# Altium project 6AxisEncoderFin.PrjPcb
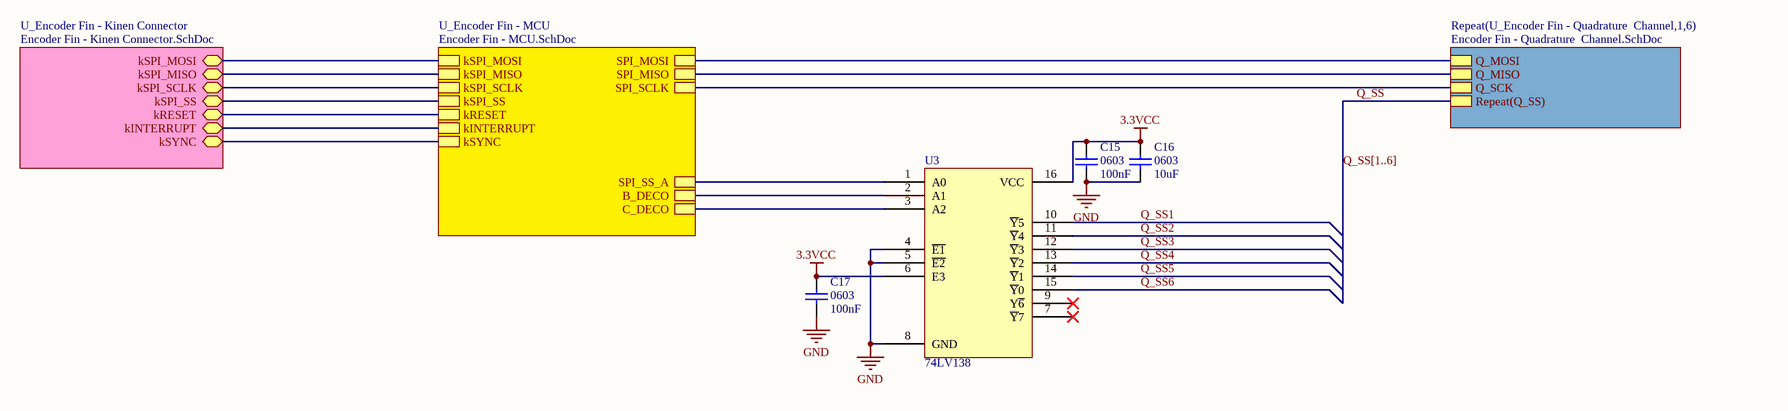
[diagram p0: Encoder Fin - System.SchDoc]
4 sheets, 79 parts. Net scope: hierarchical (ports join the sheet entries above them; power ports are global).
Board file: EncoderFin.PcbDoc
Sheets:
  Encoder Fin - System.SchDoc
    U_Encoder Fin - Quadrature  Channel1 = Encoder Fin - Quadrature  Channel.SchDoc
    U_Encoder Fin - Quadrature  Channel2 = Encoder Fin - Quadrature  Channel.SchDoc
    U_Encoder Fin - Quadrature  Channel3 = Encoder Fin - Quadrature  Channel.SchDoc
    U_Encoder Fin - Quadrature  Channel4 = Encoder Fin - Quadrature  Channel.SchDoc
    U_Encoder Fin - Quadrature  Channel5 = Encoder Fin - Quadrature  Channel.SchDoc
    U_Encoder Fin - Quadrature  Channel6 = Encoder Fin - Quadrature  Channel.SchDoc
    U_Encoder Fin - MCU = Encoder Fin - MCU.SchDoc
    U_Encoder Fin - Kinen Connector = Encoder Fin - Kinen Connector.SchDoc

## Sheet Encoder Fin - System.SchDoc
size B

### Parts
C15  0603  value 100nF  [1608[0603]]
C16  0603  value 10uF  [1608[0603]]
C17  0603  value 100nF  [1608[0603]]
U3  74LV138  [TSOP65P640X120-16N-74IC]

### Sub-sheets
Repeat(U_Encoder Fin - Quadrature  Channel,1,6) = Encoder Fin - Quadrature  Channel.SchDoc: Q_MOSI, Q_MISO, Q_SCK, Repeat(Q_SS)
U_Encoder Fin - Kinen Connector = Encoder Fin - Kinen Connector.SchDoc: kSPI_MOSI, kSPI_MISO, kSPI_SCLK, kSPI_SS, kRESET, kINTERRUPT, kSYNC
U_Encoder Fin - MCU = Encoder Fin - MCU.SchDoc: kSPI_MOSI, kSPI_MISO, kSPI_SCLK, kSPI_SS, kRESET, kINTERRUPT, kSYNC, SPI_SCLK, SPI_MISO, SPI_MOSI, B_DECO, C_DECO, SPI_SS_A

### Nets
3.3VCC: C15.2 C16.2 C17.2 U3.6(E3) U3.16(VCC)
GND: C15.1 C16.1 C17.1 U3.4(~{E1}) U3.5(~{E2}) U3.8(GND)
B_DECO: U3.2(A1) ; sheet U_Encoder Fin - MCU/B_DECO
C_DECO: U3.3(A2) ; sheet U_Encoder Fin - MCU/C_DECO
kSPI_MISO: sheet U_Encoder Fin - MCU/kSPI_MISO, sheet U_Encoder Fin - Kinen Connector/kSPI_MISO
kSPI_MOSI: sheet U_Encoder Fin - MCU/kSPI_MOSI, sheet U_Encoder Fin - Kinen Connector/kSPI_MOSI
kSPI_SCLK: sheet U_Encoder Fin - MCU/kSPI_SCLK, sheet U_Encoder Fin - Kinen Connector/kSPI_SCLK
kSPI_SS: sheet U_Encoder Fin - MCU/kSPI_SS, sheet U_Encoder Fin - Kinen Connector/kSPI_SS
Q_SS: sheet Repeat(U_Encoder Fin - Quadrature  Channel,1,6)/Repeat(Q_SS)
Q_SS1: U3.10(~{Y}5)
Q_SS2: U3.11(~{Y}4)
Q_SS3: U3.12(~{Y}3)
Q_SS4: U3.13(~{Y}2)
Q_SS5: U3.14(~{Y}1)
Q_SS6: U3.15(~{Y}0)
SPI_SS_A: U3.1(A0) ; sheet U_Encoder Fin - MCU/SPI_SS_A
NetP1_2: sheet U_Encoder Fin - MCU/kRESET, sheet U_Encoder Fin - Kinen Connector/kRESET
NetU1_33: sheet U_Encoder Fin - MCU/kSYNC, sheet U_Encoder Fin - Kinen Connector/kSYNC
NetU1_34: sheet U_Encoder Fin - MCU/kINTERRUPT, sheet U_Encoder Fin - Kinen Connector/kINTERRUPT
NetU1_42: sheet Repeat(U_Encoder Fin - Quadrature  Channel,1,6)/Q_MOSI, sheet U_Encoder Fin - MCU/SPI_MOSI
NetU1_43: sheet Repeat(U_Encoder Fin - Quadrature  Channel,1,6)/Q_MISO, sheet U_Encoder Fin - MCU/SPI_MISO
NetU1_44: sheet Repeat(U_Encoder Fin - Quadrature  Channel,1,6)/Q_SCK, sheet U_Encoder Fin - MCU/SPI_SCLK

Not connected (* = marked no-connect by the designer): U3 7(~{Y}7)* 9(Y~{6})*

### Buses and harness runs
bus Q_SS[1..6]

### Library data of the parts
C15-C17 = Cap Semi: Capacitor (Semiconductor SIM Model); Published: 8-Jun-2000; LatestRevisionDate: 29-May-2009; LatestRevisionNote: IPC-7351 Footprint Added.; PackageReference: C1206; Publisher: Altium Limited; PackageDescription: Chip Capacitor
U3 = 74LV138 - 3 to 8 Decoder NXP 3.3v/5v

## Sheet Encoder Fin - Quadrature  Channel.SchDoc
size A
Used 6 times, as channels U_Encoder Fin - Quadrature  Channel1, U_Encoder Fin - Quadrature  Channel2, U_Encoder Fin - Quadrature  Channel3, U_Encoder Fin - Quadrature  Channel4, U_Encoder Fin - Quadrature  Channel5, U_Encoder Fin - Quadrature  Channel6. Parts and nets are listed once, with the designators drawn on the sheet.
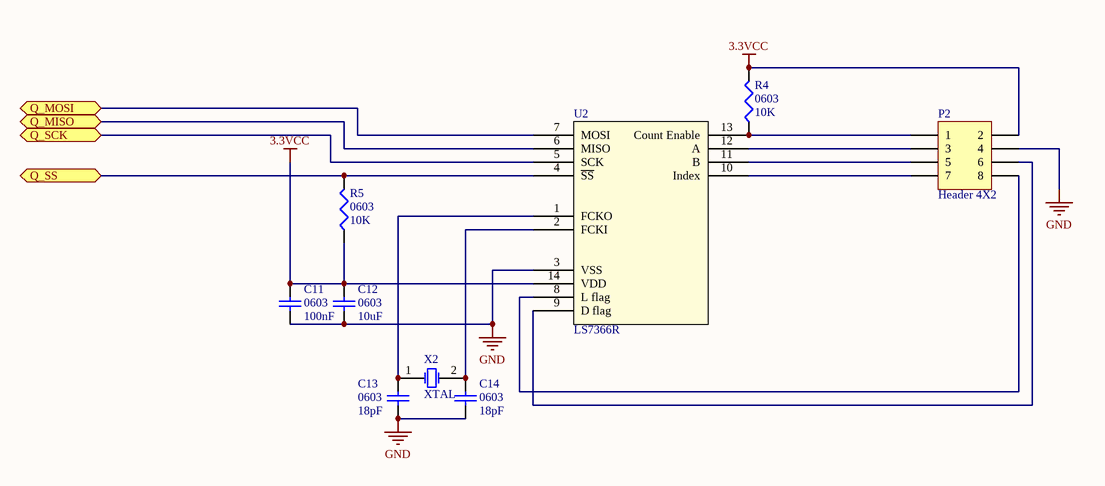
[diagram p1: Encoder Fin - Quadrature  Channel.SchDoc]

### Parts
C11  0603  value 100nF  [1608[0603]]
C12  0603  value 10uF  [1608[0603]]
C13  0603  value 18pF  [1608[0603]]
C14  0603  value 18pF  [1608[0603]]
P2  Header 4X2  [HDR2X4]
R4  0603  value 10K  [J1-0603]
R5  0603  value 10K  [J1-0603]
U2  LS7366R  [SOIC127P630X175-14N]
X2  XTAL  [ABM7-10.0000MHZ-D2Y-T]

### Ports
Q_MISO, Q_MOSI, Q_SCK, Q_SS

### Nets
3.3VCC: C11.2 C12.2 P2.2 R4.2 R5.1 U2.14(VDD)
GND: C11.1 C12.1 C13.1 C14.1 P2.4 U2.3(VSS)
Q_MISO: U2.6(MISO) ; port Q_MISO
Q_MOSI: U2.7(MOSI) ; port Q_MOSI
Q_SCK: U2.5(SCK) ; port Q_SCK
Q_SS: R5.2 U2.4(~{SS}) ; port Q_SS
NetC13_2: C13.2 U2.1(FCKO) X2.1(OSC1)
NetC14_2: C14.2 U2.2(FCKI) X2.2(OSC2)
NetP2_1: P2.1 R4.1 U2.13(Count_Enable)
NetP2_3: P2.3 U2.12(A)
NetP2_5: P2.5 U2.11(B)
NetP2_6: P2.6 U2.9(D_flag)
NetP2_7: P2.7 U2.10(Index)
NetP2_8: P2.8 U2.8(L_flag)

### Channels
U_Encoder Fin - Quadrature  Channel1: designators end in A; ports Q_MISO=NetU1_43 Q_MOSI=NetU1_42 Q_SCK=NetU1_44 Q_SS=Q_SS1
U_Encoder Fin - Quadrature  Channel2: designators end in B; ports Q_MISO=NetU1_43 Q_MOSI=NetU1_42 Q_SCK=NetU1_44 Q_SS=Q_SS2
U_Encoder Fin - Quadrature  Channel3: designators end in C; ports Q_MISO=NetU1_43 Q_MOSI=NetU1_42 Q_SCK=NetU1_44 Q_SS=Q_SS3
U_Encoder Fin - Quadrature  Channel4: designators end in D; ports Q_MISO=NetU1_43 Q_MOSI=NetU1_42 Q_SCK=NetU1_44 Q_SS=Q_SS4
U_Encoder Fin - Quadrature  Channel5: designators end in E; ports Q_MISO=NetU1_43 Q_MOSI=NetU1_42 Q_SCK=NetU1_44 Q_SS=Q_SS5
U_Encoder Fin - Quadrature  Channel6: designators end in F; ports Q_MISO=NetU1_43 Q_MOSI=NetU1_42 Q_SCK=NetU1_44 Q_SS=Q_SS6

### Library data of the parts
C11-C14 = Cap Semi: Capacitor (Semiconductor SIM Model); Published: 8-Jun-2000; LatestRevisionDate: 29-May-2009; LatestRevisionNote: IPC-7351 Footprint Added.; PackageReference: C1206; Publisher: Altium Limited; PackageDescription: Chip Capacitor
P2 = Header 4X2: Header, 4-Pin, Dual row; LatestRevisionDate: 17-Jul-2002; LatestRevisionNote: Re-released for DXP Platform.; Publisher: Altium Limited
R4 R5 = Res3: Resistor; Published: 8-Jun-2000; LatestRevisionDate: 29-May-2009; LatestRevisionNote: IPC-7351 Footprint Added.; PackageReference: J1-0603; Publisher: Altium Limited; PackageDescription: Chip Resistor
X2 = XTAL: Crystal Oscillator; Published: 8-Jun-2000; LatestRevisionDate: 17-Jul-2002; LatestRevisionNote: Re-released for DXP Platform.; PackageReference: R38; Publisher: Altium Limited; PackageDescription: Crystal, Thru-Hole; 2 Leads; Body 3.1 x 8.2 mm (Dia.xH)

## Sheet Encoder Fin - MCU.SchDoc
size A
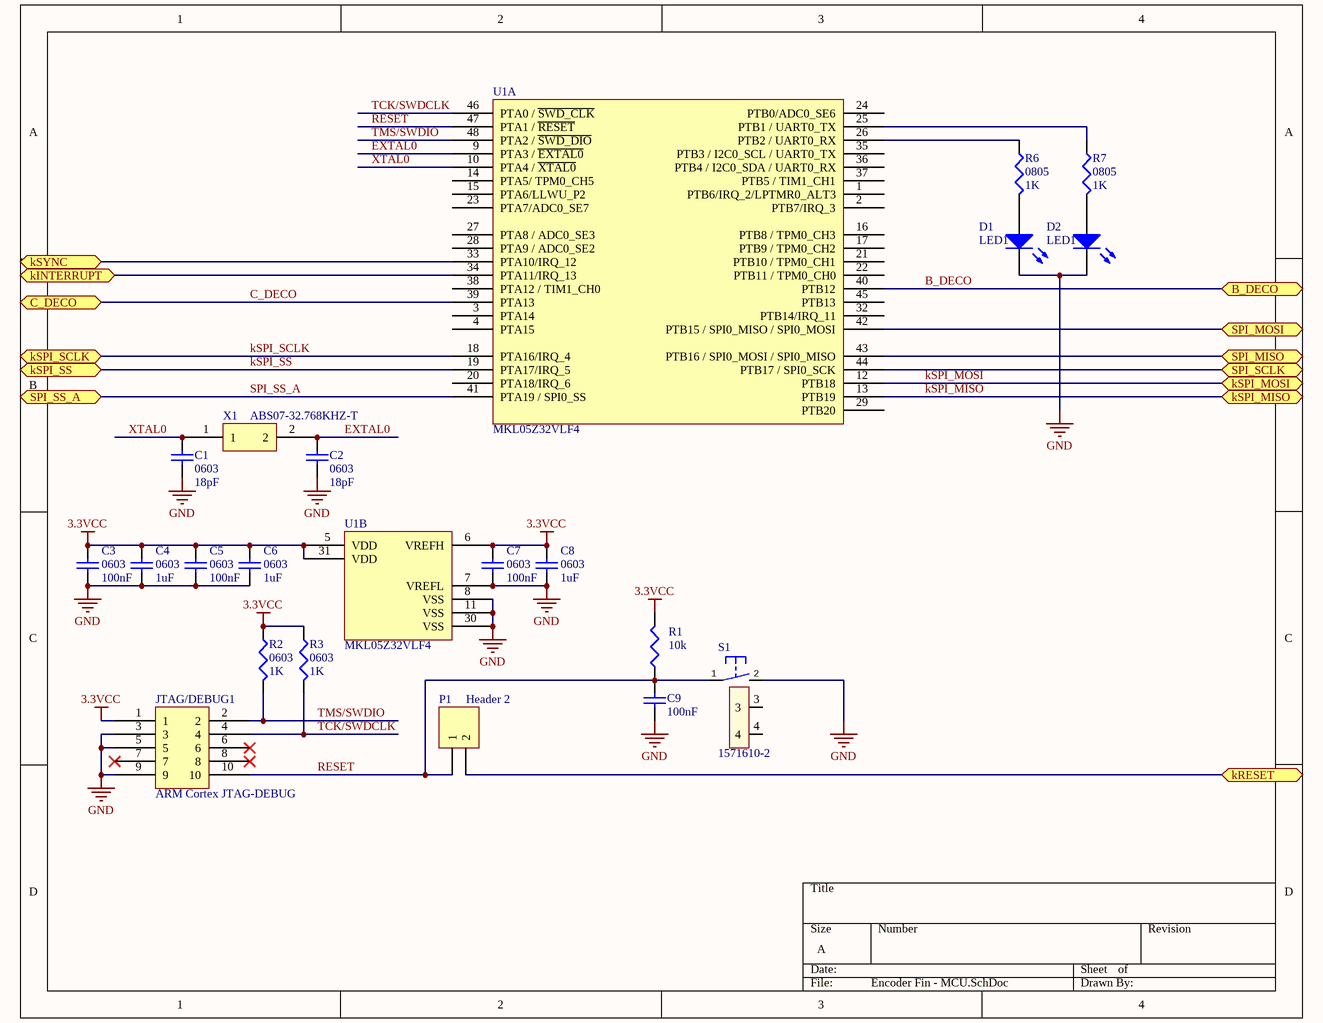
[diagram p2: Encoder Fin - MCU.SchDoc]

### Parts
C1  0603  value 18pF  [1608[0603]]
C2  0603  value 18pF  [1608[0603]]
C3  0603  value 100nF  [1608[0603]]
C4  0603  value 1uF  [1608[0603]]
C5  0603  value 100nF  [1608[0603]]
C6  0603  value 1uF  [1608[0603]]
C7  0603  value 100nF  [1608[0603]]
C8  0603  value 1uF  [1608[0603]]
C9  value 100nF  [1608[0603]]  (hidden comment: Cap Semi)
D1  LED1  [SM 0805 polarized]
D2  LED1  [SM 0805 polarized]
JTAG/DEBUG1  ARM Cortex JTAG-DEBUG  [FTSH-105-XX-X-DV]
P1  Header 2  [HDR1X2]
R1  value 10k  [J1-0603]  (hidden comment: Res3)
R2  0603  value 1K  [J1-0603]
R3  0603  value 1K  [J1-0603]
R6  0805  value 1K  [SM 0805 - gap trimmed]
R7  0805  value 1K  [SM 0805 - gap trimmed]
S1  1571610-2  [B3F-31XX]
U1  MKL05Z32VLF4  [MKL05Z32VLF4]  (parts A,B of 2)
X1  ABS07-32.768KHZ-T  [ABS07-32.768KHZ-T]

### Ports
B_DECO, C_DECO, kINTERRUPT, kRESET, kSPI_MISO, kSPI_MOSI, kSPI_SCLK, kSPI_SS, kSYNC, SPI_MISO, SPI_MOSI, SPI_SCLK, SPI_SS_A

### Nets
3.3VCC: C3.2 C4.2 C5.2 C6.2 C7.1 C8.1 JTAG/DEBUG1.1 R1.2 R2.1 R3.1 U1.5(VDD) U1.6(VREFH) U1.31(VDD)
GND: C1.2 C2.2 C3.1 C4.1 C5.1 C6.1 C7.2 C8.2 C9.1 D1.1(A) D2.1(A) JTAG/DEBUG1.3 JTAG/DEBUG1.5 JTAG/DEBUG1.9 S1.2(S) U1.7(VREFL) U1.8(VSS) U1.11(VSS) U1.30(VSS)
B_DECO: U1.40(PTB12) ; port B_DECO
C_DECO: U1.39(PTA13) ; port C_DECO
EXTAL0: C2.1 U1.9(PTA3_/_~{EXTAL0}) X1.2
kSPI_MISO: U1.13(PTB19) ; port kSPI_MISO
kSPI_MOSI: U1.12(PTB18) ; port kSPI_MOSI
kSPI_SCLK: U1.18(PTA16/IRQ_4) ; port kSPI_SCLK
kSPI_SS: U1.19(PTA17/IRQ_5) ; port kSPI_SS
RESET: C9.2 JTAG/DEBUG1.10 P1.1 R1.1 S1.1(P) U1.47(PTA1_/_~{RESET})
SPI_SS_A: U1.41(PTA19_/_SPI0_SS) ; port SPI_SS_A
TCK/SWDCLK: JTAG/DEBUG1.4 R3.2 U1.46(PTA0_/_~{SWD_CLK})
TMS/SWDIO: JTAG/DEBUG1.2 R2.2 U1.48(PTA2_/_~{SWD_DIO})
XTAL0: C1.1 U1.10(PTA4_/_~{XTAL0}) X1.1
NetD1_2: D1.2(K) R6.2
NetD2_2: D2.2(K) R7.2
NetP1_2: P1.2 ; port kRESET
NetR6_1: R6.1 U1.26(PTB2_/_UART0_RX)
NetR7_1: R7.1 U1.25(PTB1_/_UART0_TX)
NetU1_33: U1.33(PTA10/IRQ_12) ; port kSYNC
NetU1_34: U1.34(PTA11/IRQ_13) ; port kINTERRUPT
NetU1_42: U1.42(PTB15_/_SPI0_MISO_/_SPI0_MOSI) ; port SPI_MOSI
NetU1_43: U1.43(PTB16_/_SPI0_MOSI_/_SPI0_MISO) ; port SPI_MISO
NetU1_44: U1.44(PTB17_/_SPI0_SCK) ; port SPI_SCLK

Not connected (* = marked no-connect by the designer): JTAG/DEBUG1 6* 7* 8*; S1 3 4; U1 1(PTB6/IRQ_2/LPTMR0_ALT3) 2(PTB7/IRQ_3) 3(PTA14) 4(PTA15) 14(PTA5/_TPM0_CH5) 15(PTA6/LLWU_P2) 16(PTB8_/_TPM0_CH3) 17(PTB9_/_TPM0_CH2) 20(PTA18/IRQ_6) 21(PTB10_/_TPM0_CH1) 22(PTB11_/_TPM0_CH0) 23(PTA7/ADC0_SE7) 24(PTB0/ADC0_SE6) 27(PTA8_/_ADC0_SE3) 28(PTA9_/_ADC0_SE2) 29(PTB20) 32(PTB14/IRQ_11) 35(PTB3_/_I2C0_SCL_/_UART0_TX) 36(PTB4_/_I2C0_SDA_/_UART0_RX) 37(PTB5_/_TIM1_CH1) 38(PTA12_/_TIM1_CH0) 45(PTB13)

### Library data of the parts
C1-C9 = Cap Semi: Capacitor (Semiconductor SIM Model); Published: 8-Jun-2000; LatestRevisionDate: 29-May-2009; LatestRevisionNote: IPC-7351 Footprint Added.; PackageReference: C1206; Publisher: Altium Limited; PackageDescription: Chip Capacitor
D1 D2 = LED1: Typical RED GaAs LED; Published: 8-Jun-2000; LatestRevisionDate: 08-Jul-2005; LatestRevisionNote: Mech Layer 1 removed.; PackageReference: LED-1; Publisher: Altium Limited; PackageDescription: LED; 2 Leads
JTAG/DEBUG1 = ARM Cortex JTAG-DEBUG Header
P1 = Header 2: Header, 2-Pin; LatestRevisionDate: 17-Jul-2002; LatestRevisionNote: Re-released for DXP Platform.; Publisher: Altium Limited
R1-R3 R6 R7 = Res3: Resistor; Published: 8-Jun-2000; LatestRevisionDate: 29-May-2009; LatestRevisionNote: IPC-7351 Footprint Added.; PackageReference: J1-0603; Publisher: Altium Limited; PackageDescription: Chip Resistor
S1 = 1571610-2_1: SWTCH Momentary Washable; Manufacturer: Omron; Manufacturer: TE; LastRevisionNote: Import; ComponentLink1URL: http://www.te.com/commerce/DocumentDelivery/DDEController?Action=srchrtrv&DocNm=1571610&DocType=Customer+Drawing&DocLang=English; ComponentLink1Description: Datasheet for B3F-31XX; Published: 23-Apr-2014; Publisher: UltiMachine; LastRevisionDate: 23-Apr-2014; ManufacturerPartNumber: 1571610-2; Supplier 1: Mouser; Supplier Part Number 1: 506-1571610-2
U1 = MKL05Z32VLF4: ARM Cortex M0+
X1 = ABS07-32.768KHZ-T: ABS07-32.768KHZ-T RTC Crystal Oscillator

## Sheet Encoder Fin - Kinen Connector.SchDoc
size A

## Nets that join several sheets
3.3VCC: Encoder Fin - System (5 pins), U_Encoder Fin - Quadrature  Channel1 (6 pins), U_Encoder Fin - Quadrature  Channel2 (6 pins), U_Encoder Fin - Quadrature  Channel3 (6 pins), U_Encoder Fin - Quadrature  Channel4 (6 pins), U_Encoder Fin - Quadrature  Channel5 (6 pins), U_Encoder Fin - Quadrature  Channel6 (6 pins), Encoder Fin - MCU (13 pins)
GND: Encoder Fin - System (6 pins), U_Encoder Fin - Quadrature  Channel1 (6 pins), U_Encoder Fin - Quadrature  Channel2 (6 pins), U_Encoder Fin - Quadrature  Channel3 (6 pins), U_Encoder Fin - Quadrature  Channel4 (6 pins), U_Encoder Fin - Quadrature  Channel5 (6 pins), U_Encoder Fin - Quadrature  Channel6 (6 pins), Encoder Fin - MCU (19 pins)
B_DECO: Encoder Fin - System (U3.2), Encoder Fin - MCU (U1.40)
C_DECO: Encoder Fin - System (U3.3), Encoder Fin - MCU (U1.39)
NetU1_42: U_Encoder Fin - Quadrature  Channel1 (U2A.7), U_Encoder Fin - Quadrature  Channel2 (U2B.7), U_Encoder Fin - Quadrature  Channel3 (U2C.7), U_Encoder Fin - Quadrature  Channel4 (U2D.7), U_Encoder Fin - Quadrature  Channel5 (U2E.7), U_Encoder Fin - Quadrature  Channel6 (U2F.7), Encoder Fin - MCU (U1.42)
NetU1_43: U_Encoder Fin - Quadrature  Channel1 (U2A.6), U_Encoder Fin - Quadrature  Channel2 (U2B.6), U_Encoder Fin - Quadrature  Channel3 (U2C.6), U_Encoder Fin - Quadrature  Channel4 (U2D.6), U_Encoder Fin - Quadrature  Channel5 (U2E.6), U_Encoder Fin - Quadrature  Channel6 (U2F.6), Encoder Fin - MCU (U1.43)
NetU1_44: U_Encoder Fin - Quadrature  Channel1 (U2A.5), U_Encoder Fin - Quadrature  Channel2 (U2B.5), U_Encoder Fin - Quadrature  Channel3 (U2C.5), U_Encoder Fin - Quadrature  Channel4 (U2D.5), U_Encoder Fin - Quadrature  Channel5 (U2E.5), U_Encoder Fin - Quadrature  Channel6 (U2F.5), Encoder Fin - MCU (U1.44)
Q_SS1: Encoder Fin - System (U3.10), U_Encoder Fin - Quadrature  Channel1 (R5A.2 U2A.4)
Q_SS2: Encoder Fin - System (U3.11), U_Encoder Fin - Quadrature  Channel2 (R5B.2 U2B.4)
Q_SS3: Encoder Fin - System (U3.12), U_Encoder Fin - Quadrature  Channel3 (R5C.2 U2C.4)
Q_SS4: Encoder Fin - System (U3.13), U_Encoder Fin - Quadrature  Channel4 (R5D.2 U2D.4)
Q_SS5: Encoder Fin - System (U3.14), U_Encoder Fin - Quadrature  Channel5 (R5E.2 U2E.4)
Q_SS6: Encoder Fin - System (U3.15), U_Encoder Fin - Quadrature  Channel6 (R5F.2 U2F.4)
SPI_SS_A: Encoder Fin - System (U3.1), Encoder Fin - MCU (U1.41)